# Altium schematic sheet BUCK_CONVERTERS.SchDoc
size A4
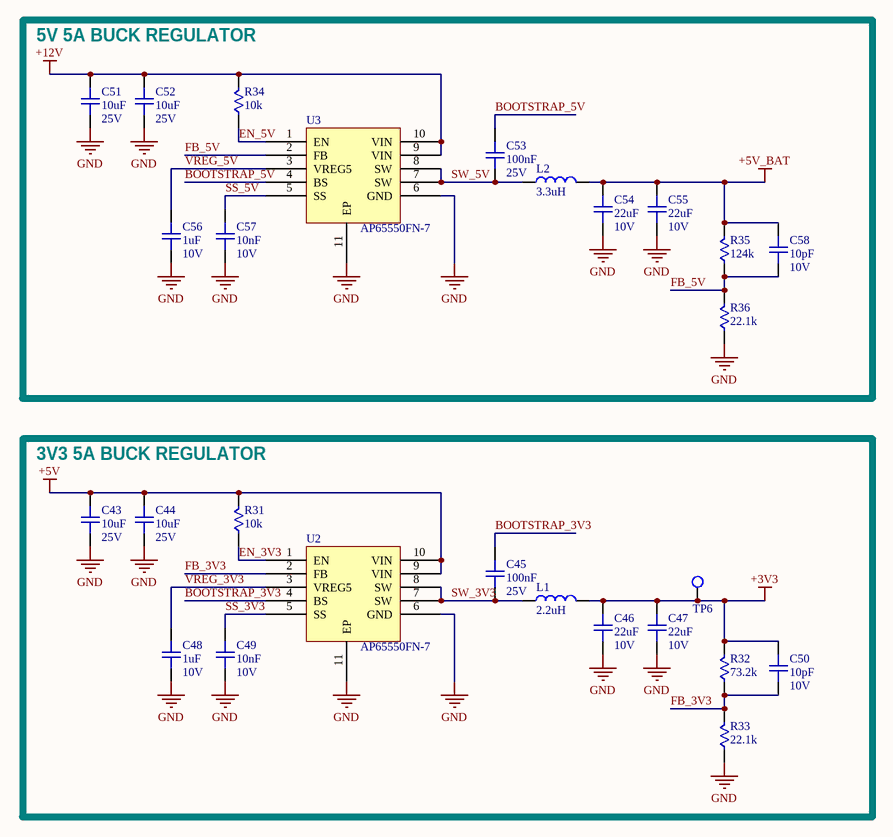
[diagram p0: BUCK_CONVERTERS.SchDoc]

## Parts
C43  10uF  Voltage Rating (DC): 25V  [R0805-3D]
C44  10uF  Voltage Rating (DC): 25V  [R0805-3D]
C45  100nF  Voltage Rating (DC): 25V  [C0402]
C46  22uF  Voltage Rating (DC): 10V  [R0805-3D]
C47  22uF  Voltage Rating (DC): 10V  [R0805-3D]
C48  1uF  Voltage Rating: 10V  [C0402]
C49  10nF  Voltage Rating: 10V  [C0402]
C50  10pF  Voltage Rating: 10V  [C0402]
C51  10uF  Voltage Rating (DC): 25V  [R0805-3D]
C52  10uF  Voltage Rating (DC): 25V  [R0805-3D]
C53  100nF  Voltage Rating (DC): 25V  [C0402]
C54  22uF  Voltage Rating (DC): 10V  [R0805-3D]
C55  22uF  Voltage Rating (DC): 10V  [R0805-3D]
C56  1uF  Voltage Rating: 10V  [C0402]
C57  10nF  Voltage Rating: 10V  [C0402]
C58  10pF  Voltage Rating: 10V  [C0402]
L1  2.2uH  [IND-6mm]
L2  3.3uH  [IND-6mm]
R31  10k  [R0402]
R32  73.2k  [R0402]
R33  22.1k  [R0402]
R34  10k  [R0402]
R35  124k  [R0402]
R36  22.1k  [R0402]
TP6  5015  [TP_HOOK]  (value not drawn)
U2  AP65550FN-7  [DFN-10]
U3  AP65550FN-7  [DFN-10]

## Blocks framed on the sheet
5V 5A BUCK REGULATOR: C51-C58 L2 R34-R36 U3
3V3 5A BUCK REGULATOR: C43-C50 L1 R31-R33 TP6 U2

## Nets
+3V3: C46.2 C47.2 C50.2 L1.2 R32.2 TP6.1
+5V: C43.2 C44.2 R31.2 U2.9(VIN) U2.10(VIN)
+5V_BAT: C54.2 C55.2 C58.2 L2.2 R35.2
+12V: C51.2 C52.2 R34.2 U3.9(VIN) U3.10(VIN)
GND: C43.1 C44.1 C46.1 C47.1 C48.1 C49.1 C51.1 C52.1 C54.1 C55.1 C56.1 C57.1 R33.1 R36.1 U2.6(GND) U2.11(EP) U3.6(GND) U3.11(EP)
BOOTSTRAP_3V3: C45.2 U2.4(BS)
BOOTSTRAP_5V: C53.2 U3.4(BS)
EN_3V3: R31.1 U2.1(EN)
EN_5V: R34.1 U3.1(EN)
FB_3V3: C50.1 R32.1 R33.2 U2.2(FB)
FB_5V: C58.1 R35.1 R36.2 U3.2(FB)
SS_3V3: C49.2 U2.5(SS)
SS_5V: C57.2 U3.5(SS)
SW_3V3: C45.1 L1.1 U2.7(SW) U2.8(SW)
SW_5V: C53.1 L2.1 U3.7(SW) U3.8(SW)
VREG_3V3: C48.2 U2.3(VREG5)
VREG_5V: C56.2 U3.3(VREG5)

## Library data of the parts
C43 C44 C51 C52 = TMK212BBJ106KG-T: CAP MLCC 10uF 25V X5R 0805; Manufacturer: Taiyo Yuden; Tolerance: 10%; Dielectric: X7R; Voltage: 16V; Supplier 1: Digi-Key; Manufacturer Part Number: TMK212BBJ106KG-T; Stock 1: 3000; Pricing 1: 1=0.21, 10=0.144, 100=0.0729, 500=0.0499, 1000=0.0441 (USD); Mount: Surface Mount; Case/Package: 0805; Number of Pins: 2; Case Code (Metric): 2012; Case Code (Imperial): 0805; Min Operating Temperature: -55°C; Max Operating Temperature: 85°C; Capacitance: 10uF; Packaging: Tape and Reel; Package Quantity: 1; Voltage Rating: 25V; Termination: SMD/SMT; Composition: Ceramic; Length: 0.079inch; Height: 1.25mm; Width: 0.049inch; Thickness: 0.053inch; Lead Free: Lead Free; REACH SVHC: No SVHC; ComponentLink1URL: https://www.yuden.co.jp/productdata/catalog/mlcc_all_e.pdf; ComponentLink1Description: https://www.yuden.co.jp/productdata/catalog/mlcc_all_e.pdf; ComponentLink2URL: http://www.farnell.com/datasheets/1481447.pdf; ComponentLink2Description: http://www.farnell.com/datasheets/1481447.pdf; Supplier Part Number 1: 587-2985-1-ND
C45 C53 = CC0402ZRY5V8BB104: CAP MLCC 0.1uF 25V Y5V 0402; Manufacturer: Yageo; Tolerance: 80%; Dissipation Factor: 12.5%; Insulation Resistance: 10GR; Supplier 1: Digi-Key; Manufacturer Part Number: CC0402ZRY5V8BB104; Stock 1: 100000; Pricing 1: 1=0.1, 10=0.031, 100=0.0136, 500=0.0097, 1000=0.0077, 2500=0.007, 5000=0.0064 (USD); Mount: Surface Mount; Case/Package: 0402; Number of Pins: 2; Weight: 2.3E-05oz; Case Code (Metric): 1005; Case Code (Imperial): 0402; Min Operating Temperature: -30°C; Max Operating Temperature: 85°C; Packaging: Tape and Reel; Capacitance: 100nF; Voltage Rating: 25V; Package Quantity: 1; Dielectric: Y5V; Termination: SMD/SMT; Composition: Ceramic; Length: 1mm; Height: 0.5mm; Width: 0.02inch; Thickness: 0.022inch; Depth: 0.5mm; Radiation Hardening: No; REACH SVHC: Unknown; Lead Free: Lead Free; Halogen Free: Halogen Free; ComponentLink1URL: http://www.yageo.com/documents/recent/UPY-GPHC_Y5V_6.3V-to-50V_8.pdf; ComponentLink1Description: http://www.yageo.com/documents/recent/UPY-GPHC_Y5V_6.3V-to-50V_8.pdf; ComponentLink2URL: http://www.farnell.com/datasheets/1132289.pdf; ComponentLink2Description: http://www.farnell.com/datasheets/1132289.pdf; ComponentLink3URL: http://www.yageo.com/documents/recent/UPY-GPHC_Y5V_6.3V-to-50V_5.pdf; ComponentLink3Description: http://www.yageo.com/documents/recent/UPY-GPHC_Y5V_6.3V-to-50V_5.pdf; Supplier Part Number 1: 311-1375-1-ND
C46 C47 C54 C55 = GRM21BR61A226ME51L: CAP MLCC 22uF 10V 0805 X5R 20% SMD 0805 85C Embossed T/R; Manufacturer: Murata; Supplier 1: Digi-Key; Manufacturer Part Number: GRM21BR61A226ME51L; Stock 1: 30000; Pricing 1: 1=0.35, 10=0.239, 100=0.1353, 500=0.0955, 1000=0.0836 (USD); Mount: Surface Mount; Case/Package: 0805; Weight: 0.000335oz; Case Code (Metric): 2012; Case Code (Imperial): 0805; Min Operating Temperature: -55°C; Max Operating Temperature: 85°C; Capacitance: 22uF; Tolerance: 20%; Packaging: Tape and Reel; Dielectric: X5R; Voltage Rating: 10V; Termination: SMD/SMT; Package Quantity: 3000; Length: 2mm; Height: 1.25mm; Width: 0.049inch; Thickness: 0.055inch; Depth: 1.25mm; Radiation Hardening: No; REACH SVHC: No SVHC; Lead Free: Lead Free; Supplier Part Number 1: 490-10511-1-ND
C48 C56 = CL05A105MP5NNNC: CAP MLCC 1uF 10V 0402 X5R 20% SMD 0402 85C Paper T/R; Manufacturer: Samsung; Supplier 1: Digi-Key; Manufacturer Part Number: CL05A105MP5NNNC; Stock 1: 100000; Pricing 1: 1=0.1, 10=0.031, 100=0.014, 500=0.01, 1000=0.0079, 2500=0.0072, 5000=0.0066 (USD); Mount: Surface Mount; Case/Package: 0402; Case Code (Metric): 1005; Case Code (Imperial): 0402; Min Operating Temperature: -55°C; Max Operating Temperature: 85°C; Package Quantity: 1; Packaging: Tape and Reel; Capacitance: 1uF; Tolerance: 20%; Dielectric: X5R; Voltage Rating (DC): 10V; Length: 1mm; Height: 0.5mm; Width: 0.02inch; Thickness: 0.022inch; Depth: 0.5mm; Radiation Hardening: No; Lead Free: Lead Free; ComponentLink1URL: https://media.digikey.com/pdf/Data%20Sheets/Samsung%20PDFs/CL_Series_MLCC_ds.pdf; ComponentLink1Description: https://media.digikey.com/pdf/Data%20Sheets/Samsung%20PDFs/CL_Series_MLCC_ds.pdf; Supplier Part Number 1: 1276-1448-1-ND
C49 C57 = GRM155R61A103KA01D: CAP MLCC 10nF 10V 0402 5R 10% SMD 0402 85C T/R; Manufacturer: Murata; Dielectric: X5R; Supplier 1: Digi-Key; Manufacturer Part Number: GRM155R61A103KA01D; Stock 1: 100000; Pricing 1: 1=0.1, 10=0.029, 100=0.013, 500=0.0093, 1000=0.0073, 2500=0.0066, 5000=0.0061 (USD); Mount: Surface Mount; Case/Package: 0402; Case Code (Metric): 1005; Case Code (Imperial): 0402; Min Operating Temperature: -55°C; Max Operating Temperature: 85°C; Tolerance: 10%; Packaging: Tape and Reel; Capacitance: 10nF; Package Quantity: 10000; Voltage Rating (DC): 10V; Termination: SMD/SMT; Length: 1mm; Height: 0.5mm; Width: 0.02inch; Thickness: 0.022inch; Depth: 0.5mm; Radiation Hardening: No; Lead Free: Lead Free; ComponentLink1URL: https://www.murata.com/~/media/webrenewal/support/library/catalog/products/capacitor/mlcc/c02e.ashx?la=en-us; ComponentLink1Description: https://www.murata.com/~/media/webrenewal/support/library/catalog/products/capacitor/mlcc/c02e.ashx?la=en-us; ComponentLink2URL: https://www.verical.com/server-webapp/html/getDatasheet?partID=330538; ComponentLink2Description: https://www.verical.com/server-webapp/html/getDatasheet?partID=330538; ComponentLink3URL: http://psearch.murata.com/capacitor/product/GRM155R61A103KA01%23.pdf; ComponentLink3Description: http://psearch.murata.com/capacitor/product/GRM155R61A103KA01%23.pdf; Supplier Part Number 1: 490-6296-1-ND
C50 C58 = 885012005007: CAP MLCC 10pF 10V 0402 C0G, NP0 0402 (1005 Metric) 0.039" L x 0.020" W (1.00mm x 0.50mm); Manufacturer: Wurth Electronics; Tolerance: 5%; Supplier 1: Digi-Key; Manufacturer Part Number: 885012005007; Stock 1: 20214; Pricing 1: 1=0.1, 10=0.018, 100=0.0159, 500=0.0141 (USD); Mount: Surface Mount; Case/Package: 0402; Case Code (Metric): 1005; Case Code (Imperial): 0402; Min Operating Temperature: -55°C; Max Operating Temperature: 125°C; Packaging: Tape and Reel; Capacitance: 10pF; Length: 0.039inch; Width: 0.02inch; Thickness: 0.022inch; Supplier Part Number 1: 732-7425-1-ND
L1 = 1255AY-2R2N=P3: IND 2.2uH 6.3A 19.2mOhm 30% 100KHz Ferrite  T/R; Manufacturer: Murata; Shielding: Shielded; DC Resistance (DCR): 19.2mR; Max DC Current: 4.7A; Supplier 1: Digi-Key; Manufacturer Part Number: 1255AY-2R2N=P3; Stock 1: 814; Pricing 1: 1=0.48, 10=0.423, 100=0.3019, 500=0.2536 (USD); Mount: Surface Mount; Case/Package: Nonstandard; Core Material: Ferrite; Packaging: Tape and Reel; Composition: Wirewound; Inductance: 2.2uh; Current Rating: 6.3A; Test Frequency: 100kHz; Tolerance: 30%; Length: 0.248inch; Width: 0.248inch; Height - Seated (Max): 0.177inch; Supplier Part Number 1: 490-10807-1-ND
L2 = 1264EY-3R3N=P3: IND 3.3µH 6.5A 25.2 mOhm Max Nonstandard; Manufacturer: Murata; Core Material: Ferrite; Shielding: Shielded; DC Resistance (DCR): 25.2mR; Test Frequency: 100kHz; Tolerance: 30%; Supplier 1: Digi-Key; Manufacturer Part Number: 1264EY-3R3N=P3; Stock 1: 81; Pricing 1: 1=0.51, 10=0.443, 100=0.3163, 500=0.2657 (USD); Mount: Surface Mount; Case/Package: Nonstandard; Packaging: Tape and Reel; Composition: Wirewound; Inductance: 3.3uh; Current Rating: 6.5A; Length: 0.248inch; Width: 0.248inch; Height - Seated (Max): 0.198inch; Supplier Part Number 1: 490-10821-1-ND
R31 R34 = RC0402JR-0710KL: RES SMD 10K OHM 5% 1/16W 0402; Manufacturer: Yageo; Resistance: 10kR; Power Rating: 62.5mW; Voltage Rating: 50V; Temperature Coefficient: 100ppm/°C; Max Power Dissipation: 63mW; Supplier 1: Digi-Key; Manufacturer Part Number: RC0402JR-0710KL; Stock 1: 47303622; Pricing 1: 1=0.1, 10=0.018, 100=0.0073, 1000=0.0033, 2500=0.0029, 5000=0.0024 (USD); Case/Package: 0402; Case Code (Metric): 1005; Case Code (Imperial): 0402; Min Operating Temperature: -55°C; Max Operating Temperature: 155°C; Packaging: Tape and Reel; Tolerance: 5%; Package Quantity: 1; Composition: Thick Film; Number of Terminations: 2; Termination: SMD/SMT; Military Standard: Not; Features: Moisture Resistant; Length: 1mm; Height: 0.016inch; Width: 0.02inch; Depth: 0.5mm; REACH SVHC: Unknown; Lead Free: Lead Free; Supplier Part Number 1: 311-10KJRCT-ND
R32 = RMCF0402FT73K2: RES SMD 73.2K Ohm 0402 1% 0.063W(1/16W) ±100ppm/C Molded SMD Automotive T/R; Manufacturer: Stackpole Electronics; Resistance: 73.2kR; Max Power Dissipation: 63mW; Temperature Coefficient: 100ppm/°C; Supplier 1: Digi-Key; Manufacturer Part Number: RMCF0402FT73K2; Stock 1: 58296; Pricing 1: 1=0.1, 10=0.016, 100=0.0064, 1000=0.0029, 2500=0.0025, 5000=0.0021 (USD); Mount: Surface Mount; Case/Package: 0402; Case Code (Metric): 1005; Case Code (Imperial): 0402; Contact Plating: Matte,Tin; Min Operating Temperature: -55°C; Max Operating Temperature: 155°C; Tolerance: 1%; Features: Automotive AEC-Q200; Packaging: Tape and Reel; Composition: Thick Film; Number of Terminations: 2; Military Standard: Not; Length: 0.039inch; Height: 0.016inch; Width: 0.02inch; Depth: 0.5mm; Lead Free: Lead Free; Supplier Part Number 1: RMCF0402FT73K2CT-ND
R33 R36 = RMCF0402FT22K1: RES SMD 22.1K 0402 Ohm 1% 1/16W ±100ppm/C Molded SMD SMD Paper T/R; Manufacturer: Stackpole Electronics; Resistance: 22.1kR; Max Power Dissipation: 63mW; Temperature Coefficient: 100ppm/°C; Supplier 1: Digi-Key; Manufacturer Part Number: RMCF0402FT22K1; Stock 1: 115582; Pricing 1: 1=0.1, 10=0.016, 100=0.0064, 1000=0.0029, 2500=0.0025, 5000=0.0021 (USD); Mount: Surface Mount; Case/Package: 0402; Case Code (Metric): 1005; Case Code (Imperial): 0402; Contact Plating: Matte,Tin; Min Operating Temperature: -55°C; Max Operating Temperature: 155°C; Tolerance: 1%; Packaging: Tape and Reel; Composition: Thick Film; Number of Terminations: 2; Features: Automotive AEC-Q200; Length: 0.039inch; Height: 0.016inch; Width: 0.02inch; Radiation Hardening: No; Lead Free: Lead Free; Supplier Part Number 1: RMCF0402FT22K1CT-ND
R35 = RMCF0402FT124K: RES SMD 124K 0402 1% 1/16W 100ppm/C Molded SMD Paper T/R; Manufacturer: Stackpole Electronics; Resistance: 124kR; Max Power Dissipation: 63mW; Temperature Coefficient: 100ppm/°C; Supplier 1: Digi-Key; Manufacturer Part Number: RMCF0402FT124K; Stock 1: 25555; Pricing 1: 1=0.1, 10=0.016, 100=0.0064, 1000=0.0029, 2500=0.0025, 5000=0.0021 (USD); Mount: Surface Mount; Case/Package: 0402; Case Code (Metric): 1005; Case Code (Imperial): 0402; Contact Plating: Matte,Tin; Min Operating Temperature: -55°C; Max Operating Temperature: 155°C; Packaging: Tape and Reel; Tolerance: 1%; Package Quantity: 10000; Composition: Thick Film; Number of Terminations: 2; Features: Automotive AEC-Q200; Length: 0.039inch; Height: 0.016inch; Width: 0.02inch; Lead Free: Lead Free; Supplier Part Number 1: RMCF0402FT124KCT-ND
TP6 = 5015: TEST POINT, PCB, SMT; Manufacturer: Keystone Electronics; Number of Ports: 1; Supplier 1: Digi-Key; Manufacturer Part Number: 5015; Stock 1: 1937775; Pricing 1: 1=0.44, 10=0.421, 25=0.3604, 50=0.3064, 100=0.2944, 250=0.2644, 500=0.2524 (USD); Mount: Surface Mount; Colour: White; Contact Material: Bronze; Contact Plating: Tin,Silver,Lead; Material: Bronze,Silver; Package Quantity: 1; Packaging: Tape and Reel; Termination: Solder; Orientation: Straight; Length: 2.66mm; Height: 0.06inch; Thickness: 0.01inch; Depth: 1.01mm; REACH SVHC: No SVHC; Lead Free: Lead Free; ComponentLink1URL: https://datasheet.ciiva.com/2917/5015-2917616.pdf; ComponentLink1Description: https://datasheet.ciiva.com/2917/5015-2917616.pdf; ComponentLink2URL: https://datasheet.ciiva.com/2917/5015-2917617.pdf; ComponentLink2Description: https://datasheet.ciiva.com/2917/5015-2917617.pdf; ComponentLink3URL: https://datasheet.ciiva.com/1123/5015-1123862.pdf; ComponentLink3Description: https://datasheet.ciiva.com/1123/5015-1123862.pdf; ComponentLink4URL: https://datasheet.ciiva.com/16883/70182998-16883734.pdf; ComponentLink4Description: https://datasheet.ciiva.com/16883/70182998-16883734.pdf; Supplier Part Number 1: 36-5015CT-ND
U2 U3 = AP65550FN-7: IC BUCK SYNC 5A, 18V VIN MAX 650kHz COT Step-Down Conv; Manufacturer: Diodes; Number of Outputs: 1; Min Input Voltage: 4.5V; Min Output Voltage: 760mV; Max Output Voltage: 6V; Synchronous Rectifier: Yes; Operating Supply Current: 900uA; Output Type: Adjustable; Output Configuration: Positive; Supplier 1: Digi-Key; Manufacturer Part Number: AP65550FN-7; Stock 1: 135; Pricing 1: 1=0.77, 10=0.68, 100=0.5212, 500=0.412, 1000=0.3296 (USD); Mount: Surface Mount; Min Operating Temperature: -40°C; Max Operating Temperature: 85°C; Packaging: Tape and Reel; Max Input Voltage: 18V; Output Current: 5A; Switching Frequency: 650kHz; Output Voltage: 6V; Package Quantity: 3000; Min Supply Voltage: 4.5V; Lead Free: Lead Free; Supplier Part Number 1: AP65550FN-7DICT-ND